# Altium schematic sheet Sheet1.SchDoc
size A4
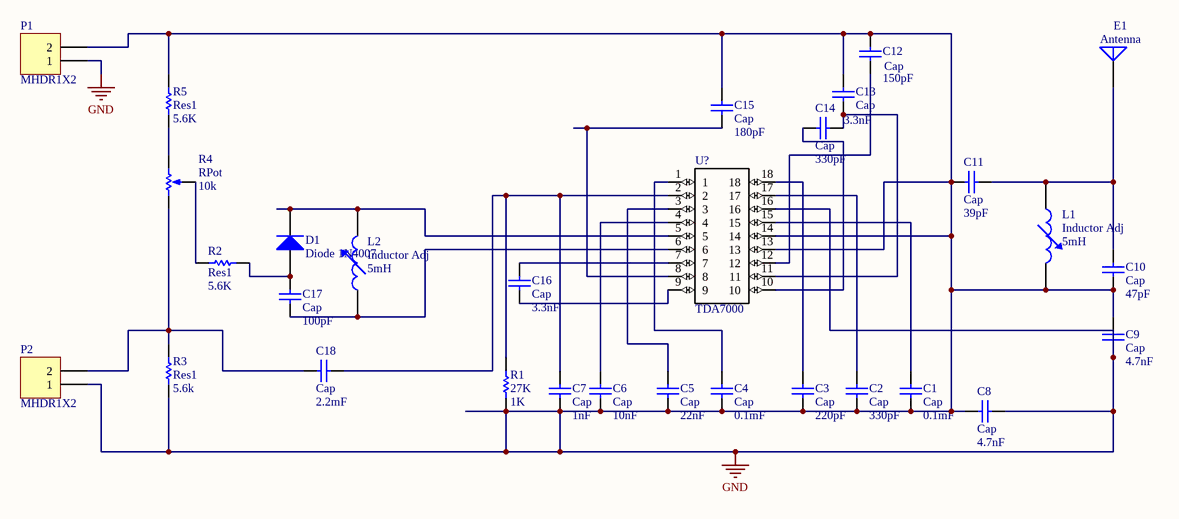
[diagram p0: Sheet1.SchDoc]

## Parts
C1  Cap  value 0.1mF  [RAD-0.3]
C2  Cap  value 330pF  [RAD-0.3]
C3  Cap  value 220pF  [RAD-0.3]
C4  Cap  value 0.1mF  [RAD-0.3]
C5  Cap  value 22nF  [RAD-0.3]
C6  Cap  value 10nF  [RAD-0.3]
C7  Cap  value 1nF  [RAD-0.3]
C8  Cap  value 4.7nF  [RAD-0.3]
C9  Cap  value 4.7nF  [RAD-0.3]
C10  Cap  value 47pF  [RAD-0.3]
C11  Cap  value 39pF  [RAD-0.3]
C12  Cap  value 150pF  [RAD-0.3]
C13  Cap  value 3.3nF  [RAD-0.3]
C14  Cap  value 330pF  [RAD-0.3]
C15  Cap  value 180pF  [RAD-0.3]
C16  Cap  value 3.3nF  [RAD-0.3]
C17  Cap  value 100pF  [RAD-0.3]
C18  Cap  value 2.2mF  [RAD-0.3]
D1  Diode 1N4007  [DO-41]
E1  Antenna  [PIN1]
L1  Inductor Adj  value 5mH  [AXIAL-0.8]
L2  Inductor Adj  value 5mH  [AXIAL-0.8]
P1  MHDR1X2  [MHDR1X2]
P2  MHDR1X2  [MHDR1X2]
R1  27K  value 1K  [AXIAL-0.3]
R2  Res1  value 5.6K  [AXIAL-0.3]
R3  Res1  value 5.6k  [AXIAL-0.3]
R4  RPot  value 10k  [VR5]
R5  Res1  value 5.6K  [AXIAL-0.3]
U?  TDA7000  [*DIP802W45P254L2180H470Q18]

## Nets
GND: C1.1 C2.1 C3.1 C4.1 C5.1 C6.1 C7.1 C8.1 C8.2 C9.1 C9.2 C10.1 C11.1 C12.2 C13.1 C15.2 L1.2 P1.1 P1.2 P2.1 R1.1 R3.1 R5.2 U?.13 U?.14 U?.16
NetC1_2: C1.2 U?.15
NetC2_2: C2.2 U?.17
NetC3_2: C3.2 U?.18
NetC4_2: C4.2 U?.1
NetC5_2: C5.2 U?.3
NetC6_2: C6.2 U?.4
NetC7_2: C7.2 C18.2 R1.2 U?.2
NetC10_2: C10.2 C11.2 E1.1(A) L1.1
NetC12_1: C12.1 U?.12
NetC13_2: C13.2 C14.2 U?.11
NetC14_1: C14.1 U?.10
NetC15_1: C15.1 U?.8
NetC16_1: C16.1 U?.9
NetC16_2: C16.2 U?.7
NetC17_1: C17.1 L2.1 U?.6
NetC17_2: C17.2 D1.1(A) R2.2
NetC18_1: C18.1 P2.2 R3.2 R4.1(TOP)
NetD1_2: D1.2(K) L2.2 U?.5
NetR2_1: R2.1 R4.3(TAP)
NetR4_2: R4.2(BOT) R5.1

## Library data of the parts
C1-C18 = Cap: Capacitor; Published: 8-Jun-2000; LatestRevisionDate: 17-Jul-2002; LatestRevisionNote: Re-released for DXP Platform.; PackageReference: RAD-0.3; Publisher: Altium Limited; PackageDescription: Radial Cap, Thru-Hole; 2 Leads; 0.3 in Pin Spacing
D1 = Diode 1N4007: 1 Amp General Purpose Rectifier; Published: 8-Jun-2000; LatestRevisionDate: 17-Jul-2002; LatestRevisionNote: Re-released for DXP Platform.; DatasheetVersion: 1998; PackageVersion: Aug-1999; PackageReference: DO-41; Publisher: Altium Limited; PackageDescription: Diode, Axial; Body 5.2 x 2.7 mm (LxDia. max), Lead Dia. 0.86 mm (max); Code_JEDEC: DO-204-AL; ComponentLink1Description: Manufacturer Link; ComponentLink1URL: http://www.fairchildsemi.com/; ComponentLink2Description: Datasheet; ComponentLink2URL: http://www.fairchildsemi.com/ds/1N%2F1N4001.pdf
E1 = Antenna: Generic Antenna; Published: 24-Mar-1999; LatestRevisionDate: 17-Jul-2002; LatestRevisionNote: Re-released for DXP Platform.; PackageReference: PIN1; Publisher: Altium Limited
L1 L2 = Inductor Adj: Adjustable Inductor; Set Position: 0.5; Published: 24-Mar-1999; LatestRevisionDate: 17-Jul-2002; LatestRevisionNote: Re-released for DXP Platform.; PackageReference: AXIAL-0.8; Publisher: Altium Limited; PackageDescription: Axial Device, Thru-Hole; 2 Leads; 0.8 in Pin Spacing
P1 P2 = MHDR1X2: Header, 2-Pin; LatestRevisionDate: 17-Jul-2002; LatestRevisionNote: Re-released for DXP Platform.; Publisher: Altium Limited
R1-R3 R5 = Res1: Resistor; Published: 8-Jun-2000; LatestRevisionDate: 17-Jul-2002; LatestRevisionNote: Re-released for DXP Platform.; PackageReference: AXIAL-0.3; Publisher: Altium Limited; PackageDescription: Axial Device, Thru-Hole; 2 Leads; 0.3 in Pin Spacing
R4 = RPot: Potentiometer; Sim Note: Enter the Resistance value and the set point into parameter fields.; Set Position: 0.5; Published: 8-Jun-2000; LatestRevisionDate: 17-Jul-2002; LatestRevisionNote: Re-released for DXP Platform.; PackageReference: VR5; Publisher: Altium Limited; PackageDescription: Variable Resistor, Thru-Hole; 3 Leads
U? = TDA7000: Value: *